# EAGLE design Hardwin01_Cover (EAGLE 7.7.0)
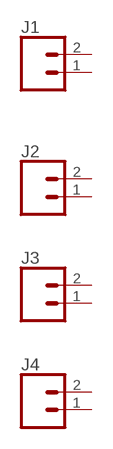
[diagram p0: schematic, sheet 1]

## Parts
J1  CONN_021X02_NO_SILK  [1X02_NO_SILK]
J2  CONN_021X02_NO_SILK  [1X02_NO_SILK]
J3  CONN_021X02_NO_SILK  [1X02_NO_SILK]
J4  CONN_021X02_NO_SILK  [1X02_NO_SILK]
Unconnected: J1.1 J1.2 J2.1 J2.2 J3.1 J3.2 J4.1 J4.2

## Library data of the parts
J1-J4 = SparkFun-Connectors:CONN_02: Multi connection point. Often used as Generic Header-pin footprint for 0.1 inch spaced/style header connections On any of the 0.1 inch spaced packages, you can populate with these: Break Away Headers - Straight <https://www.sparkfun.com/products/116> (PRT-00116) Break Away Male Headers - Right Angle <https://www.sparkfun.com/products/553> (PRT-00553) Female Headers <https://www.sparkfun.com/products/115> (PRT-00115) Break Away Headers - Machine Pin <https://www.sparkfun.com/products/117> (PRT-00117) Break Away Female Headers - Swiss Machine Pin <https://www.sparkfun.com/products/743> (PRT-00743) For SCREWTERMINALS and SPRING TERMINALS visit here: Screw Terimnals on SparkFun.com <https://www.sparkfun.com/search/results?term=Screw+Terminals> (5mm/3.5mm/2.54mm spacing) This device is also useful as a general connection point to wire up your design to another part of your project. Our various solder wires solder well into these plated through hole pads. Hook-Up Wire - Assortment (Stranded, 22 AWG) <https://www.sparkfun.com/products/11375> (PRT-11375) Hook-Up Wire - Assortment (Solid Core, 22 AWG) <https://www.sparkfun.com/products/11367> (PRT-11367) View the entire wire category on our website here <https://www.sparkfun.com/categories/141> Special notes: Molex polarized connector foot print use with: PRT-08233 with associated crimp pins and housings. 2.54_SCREWTERM for use with PRT-10571. 3.5mm Screw Terminal footprints for PRT-08084 5mm Screw Terminal footprints for use with PRT-08432

## Net classes
0 default: width 0.152 mm

## Board
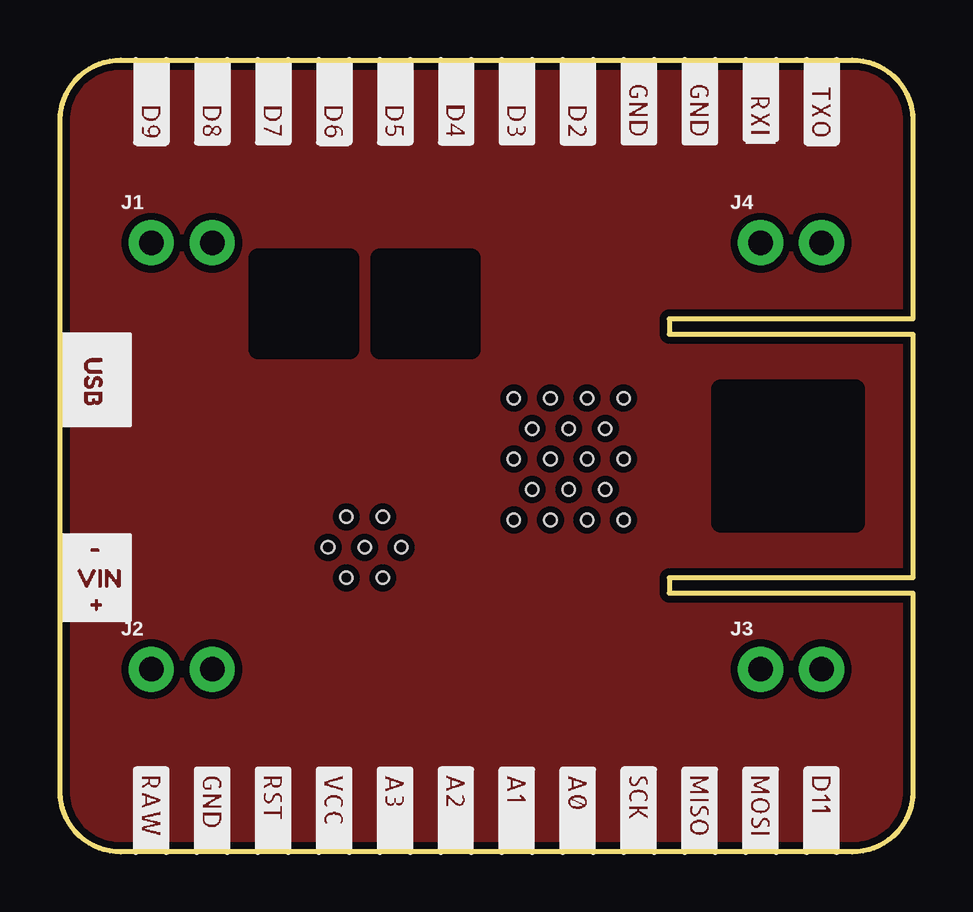
[diagram p1: board, top side]
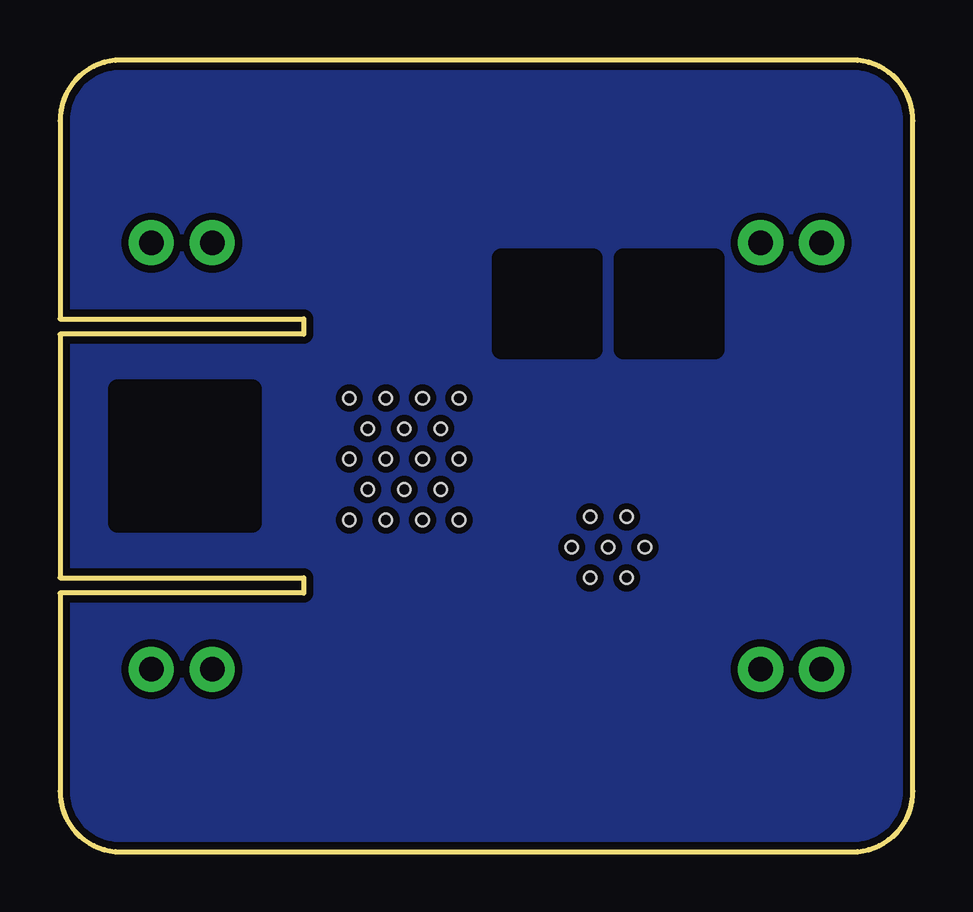
[diagram p2: board, bottom side, seen from below]

Size 35.56 x 33.02 mm. Coordinates in mm from the lower left corner, seen from the top.
Outline: 2.54,33.02 33.02,33.02 arc-90 35.56,30.48 35.56,22.23 25.4,22.23 25.4,21.59 35.56,21.59 35.56,11.43 25.4,11.43 25.4,10.79 35.56,10.79 35.56,2.54 arc-90 33.02,0 2.54,0 arc-90 0,2.54 0,30.48 arc-90 2.54,33.02
Copper layers (1*16): Top 0.035mm / dielectric 1.5mm / Bottom 0.035mm
Design rules "SparkFun-2-layer-PCBWay-LIMIT": minimum track width 6mil, minimum drill 0.3mm, track to track 6mil, track to pad 6mil, pad to pad 6mil, via to via 6mil, smd to smd 6mil, copper to edge 6mil, drill to drill 6mil, minimum pad ring 7mil, minimum via ring 7mil, stop-mask expansion 4mil, vias tented up to drill 25mil, thermal gap 10mil
Holes 0.51 mm at 18.92,18.92 20.45,18.92 21.97,18.92 23.5,18.92 19.68,17.65 21.21,17.65 22.73,17.65 20.45,16.38 21.97,16.38 18.92,16.38 23.5,16.38 19.68,15.11 21.21,15.11 22.73,15.11 20.45,13.84 21.97,13.84 18.92,13.84 23.5,13.84 11.94,13.97 13.46,13.97 11.18,12.7 12.7,12.7 14.22,12.7 11.94,11.43 13.46,11.43
tRestrict: area 27.6,13.7 to 33.1,19.3; area 8.3,21 to 12.1,24.8; area 13.3,21 to 17.1,24.8
bRestrict: area 27.6,13.7 to 33.1,19.3; area 8.3,21 to 12.1,24.8; area 13.3,21 to 17.1,24.8

### Footprints (pad centres in the part's own frame; a part is rotated, then mirrored left to right if it is on the bottom)
1X02_NO_SILK = drill 1.016 pad 1.88: 1 0,0; 2 2.54,0

### Placement (x,y rotation side)
J1  3.81,25.4 0 top
J2  3.81,7.62 0 top
J3  29.21,7.62 0 top
J4  29.21,25.4 0 top
U$1  [RESET#PNG]  30.35,16.51 0 top
U$2  [RX#PNG]  15.24,22.86 0 top
U$3  [RAW19]  3.81,3.94 270 top
U$4  [TX#PNG]  10.16,22.86 0 top
U$5  [HARDWINLOGO2#PNG]  17.4,7.49 0 top
U$6  [SIGDITCHICO#PNG]  20.32,22.86 0 top
U$7  [GND20]  6.35,3.94 270 top
U$8  [RST21]  8.89,3.94 270 top
U$9  [VCC17]  11.43,3.94 270 top
U$10  [A314]  13.97,3.94 270 top
U$11  [A211]  16.51,3.94 270 top
U$12  [A110]  19.05,3.94 270 top
U$13  [A08]  21.59,3.94 270 top
U$14  [SCK7]  24.13,3.94 270 top
U$15  [MISO6]  26.67,3.94 270 top
U$16  [MOSI4]  29.21,3.94 270 top
U$17  [D112]  31.75,3.94 270 top
U$18  [D91]  3.81,31.88 270 top
U$19  [D80]  6.35,31.88 270 top
U$20  [D722]  8.89,31.88 270 top
U$21  [D616]  11.43,31.88 270 top
U$22  [D513]  13.97,31.88 270 top
U$23  [D412]  16.51,31.88 270 top
U$24  [D318]  19.05,31.88 270 top
U$25  [D29]  21.59,31.88 270 top
U$26  [GND20]  24.13,32.77 270 top
U$27  [GND20]  26.67,32.77 270 top
U$28  [RXI5]  29.21,32.26 270 top
U$29  [TXO15]  31.75,32.64 270 top
U$30  [USB0]  1.4,21.34 270 top
U$31  [__#1]  0,10.29 0 top
U$32  [__#2]  0,12.57 0 top
U$33  [VIN0]  0,11.43 0 top

### Tracks (layer width: path | path; a pad name or v marks a point on that pad's centre or on a via)
N$9
  pour Top (isolate 0.305): 2.54,33.02 33.02,33.02 arc-90 35.56,30.48 35.56,22.23 25.4,22.23 25.4,21.59 35.56,21.59 35.56,11.43 25.4,11.43 25.4,10.79 35.56,10.79 35.56,2.54 arc-90 33.02,0 2.54,0 arc-90 0,2.54 0,30.48 arc-90
N$10
  pour Bottom (isolate 0.305): 2.54,33.02 33.02,33.02 arc-90 35.56,30.48 35.56,22.23 25.4,22.23 25.4,21.59 35.56,21.59 35.56,11.43 25.4,11.43 25.4,10.79 35.56,10.79 35.56,2.54 arc-90 33.02,0 2.54,0 arc-90 0,2.54 0,30.48 arc-90